# EAGLE design cryobondr-sense1-vlaqc-test2 (EAGLE 9.0.1)
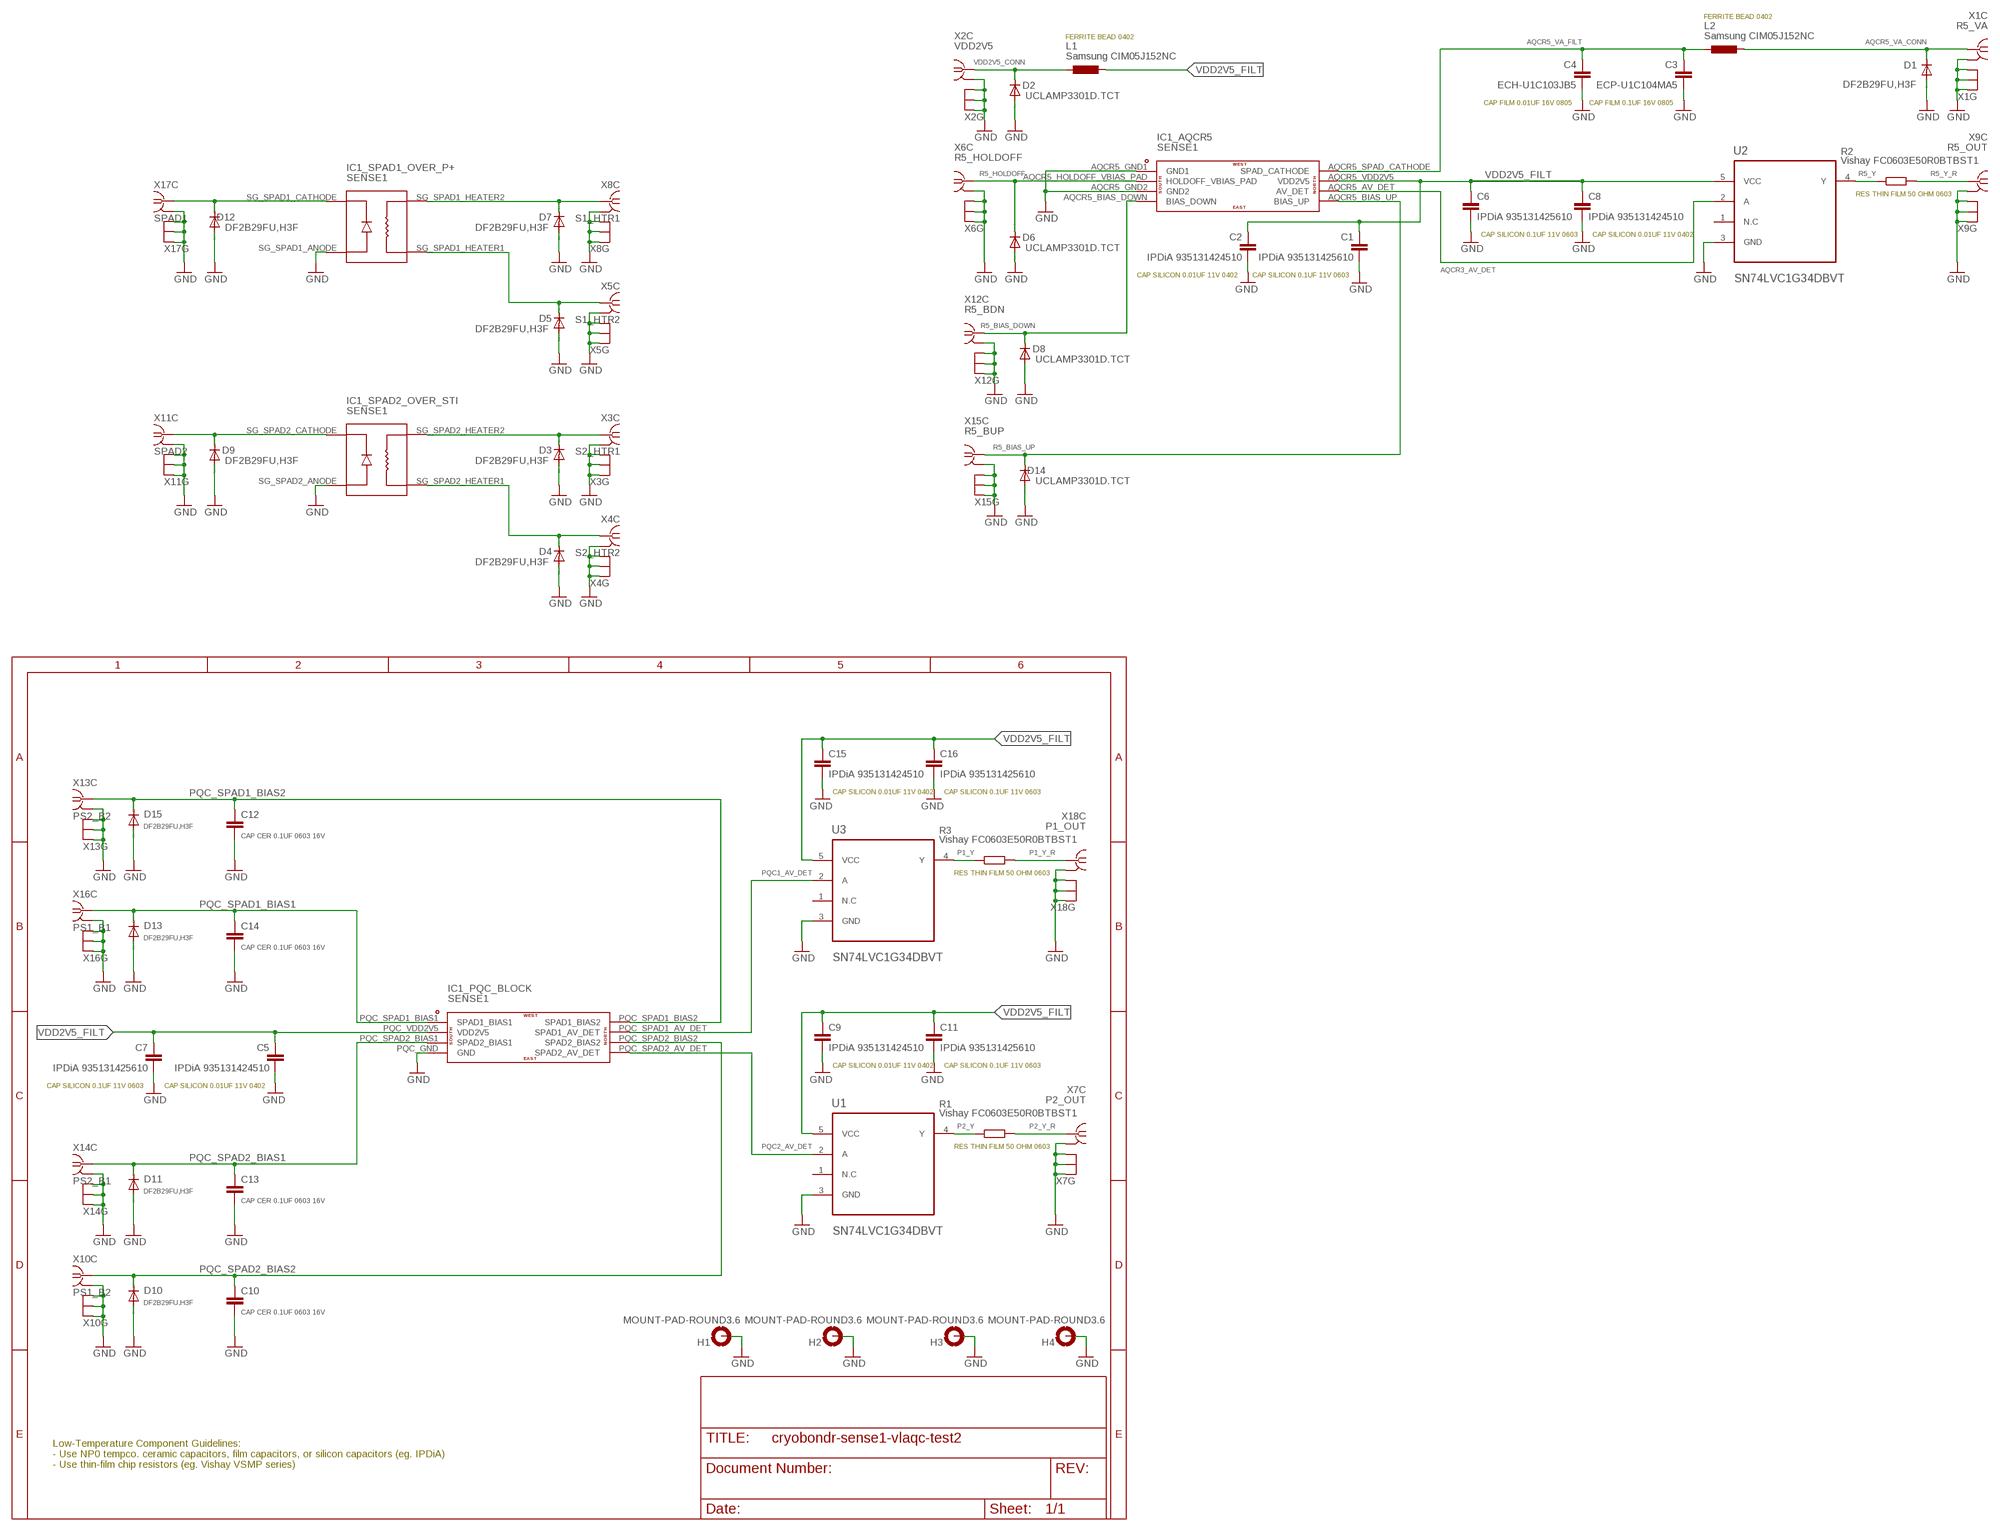
[diagram p0: schematic, sheet 1]

## Parts
C1  IPDiA 935131425610  C-EUC0603  [C0603]
C2  IPDiA 935131424510  C-EUC0402  [C0402]
C3  ECP-U1C104MA5  C-EUC0805  [C0805]
C4  ECH-U1C103JB5  C-EUC0805  [C0805]
C5  IPDiA 935131424510  C-EUC0402  [C0402]
C6  IPDiA 935131425610  C-EUC0603  [C0603]
C7  IPDiA 935131425610  C-EUC0603  [C0603]
C8  IPDiA 935131424510  C-EUC0402  [C0402]
C9  IPDiA 935131424510  C-EUC0402  [C0402]
C10  CAP CER 0.1UF 0603 16V  C-EUC0603  [C0603]
C11  IPDiA 935131425610  C-EUC0603  [C0603]
C12  CAP CER 0.1UF 0603 16V  C-EUC0603  [C0603]
C13  CAP CER 0.1UF 0603 16V  C-EUC0603  [C0603]
C14  CAP CER 0.1UF 0603 16V  C-EUC0603  [C0603]
C15  IPDiA 935131424510  C-EUC0402  [C0402]
C16  IPDiA 935131425610  C-EUC0603  [C0603]
D1  DF2B29FU,H3F  DIODE-SOD323-R  [SOD323-R]
D2  UCLAMP3301D.TCT  DIODE-SOD323-R  [SOD323-R]
D3  DF2B29FU,H3F  DIODE-SOD323-R  [SOD323-R]
D4  DF2B29FU,H3F  DIODE-SOD323-R  [SOD323-R]
D5  DF2B29FU,H3F  DIODE-SOD323-R  [SOD323-R]
D6  UCLAMP3301D.TCT  DIODE-SOD323-R  [SOD323-R]
D7  DF2B29FU,H3F  DIODE-SOD323-R  [SOD323-R]
D8  UCLAMP3301D.TCT  DIODE-SOD323-R  [SOD323-R]
D9  DF2B29FU,H3F  DIODE-SOD323-R  [SOD323-R]
D10  DF2B29FU,H3F  DIODE-SOD323-R  [SOD323-R]
D11  DF2B29FU,H3F  DIODE-SOD323-R  [SOD323-R]
D12  DF2B29FU,H3F  DIODE-SOD323-R  [SOD323-R]
D13  DF2B29FU,H3F  DIODE-SOD323-R  [SOD323-R]
D14  UCLAMP3301D.TCT  DIODE-SOD323-R  [SOD323-R]
D15  DF2B29FU,H3F  DIODE-SOD323-R  [SOD323-R]
H1  MOUNT-PAD-ROUND3.6  [3,6-PAD]
H2  MOUNT-PAD-ROUND3.6  [3,6-PAD]
H3  MOUNT-PAD-ROUND3.6  [3,6-PAD]
H4  MOUNT-PAD-ROUND3.6  [3,6-PAD]
IC1  SENSE1  SENSE1-WIREBOND-VLAQC-TEST2  [SENSE1-WIREBOND-VLAQC-TEST2]
L1  Samsung CIM05J152NC  INDUCTOR0402  [R0402]
L2  Samsung CIM05J152NC  INDUCTOR0402  [R0402]
R1  Vishay FC0603E50R0BTBST1  R-EU_R0603  [R0603]
R2  Vishay FC0603E50R0BTBST1  R-EU_R0603  [R0603]
R3  Vishay FC0603E50R0BTBST1  R-EU_R0603  [R0603]
U1  SN74LVC1G34DBVT  [SOT95P280X145-5N]
U2  SN74LVC1G34DBVT  [SOT95P280X145-5N]
U3  SN74LVC1G34DBVT  [SOT95P280X145-5N]
X1  R5_VA  MMCXBIGPAD  [MMCX-SMT-BIGPADS]
X2  VDD2V5  MMCXBIGPAD  [MMCX-SMT-BIGPADS]
X3  S2_HTR1  MMCXBIGPAD  [MMCX-SMT-BIGPADS]
X4  S2_HTR2  MMCXBIGPAD  [MMCX-SMT-BIGPADS]
X5  S1_HTR2  MMCXBIGPAD  [MMCX-SMT-BIGPADS]
X6  R5_HOLDOFF  MMCXBIGPAD  [MMCX-SMT-BIGPADS]
X7  P2_OUT  MMCXBIGPAD  [MMCX-SMT-BIGPADS]
X8  S1_HTR1  MMCXBIGPAD  [MMCX-SMT-BIGPADS]
X9  R5_OUT  MMCXBIGPAD  [MMCX-SMT-BIGPADS]
X10  PS1_B2  MMCXBIGPAD  [MMCX-SMT-BIGPADS]
X11  SPAD2  MMCXBIGPAD  [MMCX-SMT-BIGPADS]
X12  R5_BDN  MMCXBIGPAD  [MMCX-SMT-BIGPADS]
X13  PS2_B2  MMCXBIGPAD  [MMCX-SMT-BIGPADS]
X14  PS2_B1  MMCXBIGPAD  [MMCX-SMT-BIGPADS]
X15  R5_BUP  MMCXBIGPAD  [MMCX-SMT-BIGPADS]
X16  PS1_B1  MMCXBIGPAD  [MMCX-SMT-BIGPADS]
X17  SPAD1  MMCXBIGPAD  [MMCX-SMT-BIGPADS]
X18  P1_OUT  MMCXBIGPAD  [MMCX-SMT-BIGPADS]

## Nets
AQCR3_AV_DET: IC1.AQCR5_AV_DET(_AQCR5:AV_DET) U2.2(A)
AQCR5_VA_CONN: D1.C L2.2 X1.S
AQCR5_VA_FILT: C3.1 C4.1 IC1.AQCR5_SPAD_CATHODE(_AQCR5:SPAD_CATHODE) L2.1
GND: C1.2 C2.2 C3.2 C4.2 C5.2 C6.2 C7.2 C8.2 C9.2 C10.2 C11.2 C12.2 C13.2 C14.2 C15.2 C16.2 D1.A D2.A D3.A D4.A D5.A D6.A D7.A D8.A D9.A D10.A D11.A D12.A D13.A D14.A D15.A H1.B3,6(MOUNT) H2.B3,6(MOUNT) H3.B3,6(MOUNT) H4.B3,6(MOUNT) IC1.AQCR5_GND1(_AQCR5:GND1) IC1.AQCR5_GND2(_AQCR5:GND2) IC1.PQC_GND(_PQC_BLOCK:GND) IC1.SG_SPAD1_ANODE(_SPAD1_OVER_P+:SPAD_ANODE) IC1.SG_SPAD2_ANODE(_SPAD2_OVER_STI:SPAD_ANODE) U1.3(GND) U2.3(GND) U3.3(GND) X1.G1(C:GND) X1.G2(G:GND) X1.G3(G:GND) X1.G4(G:GND) X2.G1(C:GND) X2.G2(G:GND) X2.G3(G:GND) X2.G4(G:GND) X3.G1(C:GND) X3.G2(G:GND) X3.G3(G:GND) X3.G4(G:GND) X4.G1(C:GND) X4.G2(G:GND) X4.G3(G:GND) X4.G4(G:GND) X5.G1(C:GND) X5.G2(G:GND) X5.G3(G:GND) X5.G4(G:GND) X6.G1(C:GND) X6.G2(G:GND) X6.G3(G:GND) X6.G4(G:GND) X7.G1(C:GND) X7.G2(G:GND) X7.G3(G:GND) X7.G4(G:GND) X8.G1(C:GND) X8.G2(G:GND) X8.G3(G:GND) X8.G4(G:GND) X9.G1(C:GND) X9.G2(G:GND) X9.G3(G:GND) X9.G4(G:GND) X10.G1(C:GND) X10.G2(G:GND) X10.G3(G:GND) X10.G4(G:GND) X11.G1(C:GND) X11.G2(G:GND) X11.G3(G:GND) X11.G4(G:GND) X12.G1(C:GND) X12.G2(G:GND) X12.G3(G:GND) X12.G4(G:GND) X13.G1(C:GND) X13.G2(G:GND) X13.G3(G:GND) X13.G4(G:GND) X14.G1(C:GND) X14.G2(G:GND) X14.G3(G:GND) X14.G4(G:GND) X15.G1(C:GND) X15.G2(G:GND) X15.G3(G:GND) X15.G4(G:GND) X16.G1(C:GND) X16.G2(G:GND) X16.G3(G:GND) X16.G4(G:GND) X17.G1(C:GND) X17.G2(G:GND) X17.G3(G:GND) X17.G4(G:GND) X18.G1(C:GND) X18.G2(G:GND) X18.G3(G:GND) X18.G4(G:GND)
P1_Y: R3.1 U3.4(Y)
P1_Y_R: R3.2 X18.S
P2_Y: R1.1 U1.4(Y)
P2_Y_R: R1.2 X7.S
PQC1_AV_DET: IC1.PQC_SPAD1_AV_DET(_PQC_BLOCK:SPAD1_AV_DET) U3.2(A)
PQC2_AV_DET: IC1.PQC_SPAD2_AV_DET(_PQC_BLOCK:SPAD2_AV_DET) U1.2(A)
PQC_SPAD1_BIAS1: C14.1 D13.C IC1.PQC_SPAD1_BIAS1(_PQC_BLOCK:SPAD1_BIAS1) X16.S
PQC_SPAD1_BIAS2: C12.1 D15.C IC1.PQC_SPAD1_BIAS2(_PQC_BLOCK:SPAD1_BIAS2) X13.S
PQC_SPAD2_BIAS1: C13.1 D11.C IC1.PQC_SPAD2_BIAS1(_PQC_BLOCK:SPAD2_BIAS1) X14.S
PQC_SPAD2_BIAS2: C10.1 D10.C IC1.PQC_SPAD2_BIAS2(_PQC_BLOCK:SPAD2_BIAS2) X10.S
R5_BIAS_DOWN: D8.C IC1.AQCR5_BIAS_DOWN(_AQCR5:BIAS_DOWN) X12.S
R5_BIAS_UP: D14.C IC1.AQCR5_BIAS_UP(_AQCR5:BIAS_UP) X15.S
R5_HOLDOFF: D6.C IC1.AQCR5_HOLDOFF_VBIAS_PAD(_AQCR5:HOLDOFF_VBIAS_PAD) X6.S
R5_Y: R2.1 U2.4(Y)
R5_Y_R: R2.2 X9.S
SPAD1_CATH: D12.C IC1.SG_SPAD1_CATHODE(_SPAD1_OVER_P+:SPAD_CATHODE) X17.S
SPAD1_HTR: D7.C IC1.SG_SPAD1_HEATER2(_SPAD1_OVER_P+:SPAD_HEATER2) X8.S
SPAD1_HTR1: D3.C IC1.SG_SPAD2_HEATER2(_SPAD2_OVER_STI:SPAD_HEATER2) X3.S
SPAD2_CATH: D9.C IC1.SG_SPAD2_CATHODE(_SPAD2_OVER_STI:SPAD_CATHODE) X11.S
SPAD2_HTR: D5.C IC1.SG_SPAD1_HEATER1(_SPAD1_OVER_P+:SPAD_HEATER1) X5.S
SPAD2_HTR1: D4.C IC1.SG_SPAD2_HEATER1(_SPAD2_OVER_STI:SPAD_HEATER1) X4.S
VDD2V5_CONN: D2.C L1.1 X2.S
VDD2V5_FILT: C1.1 C2.1 C5.1 C6.1 C7.1 C8.1 C9.1 C11.1 C15.1 C16.1 IC1.AQCR5_VDD2V5(_AQCR5:VDD2V5) IC1.PQC_VDD2V5(_PQC_BLOCK:VDD2V5) L1.2 U1.5(VCC) U2.5(VCC) U3.5(VCC)
Unconnected: U1.1(N.C) U2.1(N.C) U3.1(N.C)

## Notes on the sheet
- FERRITE BEAD 0402
- FERRITE BEAD 0402
- CAP FILM 0.01UF 16V 0805 | CAP FILM 0.1UF 16V 0805
- RES THIN FILM 50 OHM 0603
- CAP SILICON 0.1UF 11V 0603 | CAP SILICON 0.01UF 11V 0402
- CAP SILICON 0.01UF 11V 0402 | CAP SILICON 0.1UF 11V 0603
- CAP SILICON 0.01UF 11V 0402 | CAP SILICON 0.1UF 11V 0603
- RES THIN FILM 50 OHM 0603
- CAP SILICON 0.01UF 11V 0402 | CAP SILICON 0.1UF 11V 0603
- CAP SILICON 0.1UF 11V 0603 | CAP SILICON 0.01UF 11V 0402
- RES THIN FILM 50 OHM 0603
- Low-Temperature Component Guidelines:
  - Use NP0 tempco. ceramic capacitors, film capacitors, or silicon capacitors (eg. IPDiA)
  - Use thin-film chip resistors (eg. Vishay VSMP series)

## Library data of the parts
C1-C16 = rcl-modified-footprints:C-EU: CAPACITOR, European symbol
D1-D15 = diode:DIODE-: DIODE
H1-H4 = holes:MOUNT-PAD-ROUND: MOUNTING PAD, round
IC1 = meng:SENSE1-WIREBOND-VLAQC-TEST2
L1 L2 = meng:INDUCTOR
R1-R3 = rcl-modified-footprints:R-EU_: RESISTOR, European symbol
U1-U3 = Texas Instruments_By_element14_Batch_1:SN74LVC1G34DBVT: SINGLE BUFFER GATE; MPN: SN74LVC1G34DBVT; OC_FARNELL: 1494933; OC_NEWARK: 01J0788; PACKAGE: SOT-5; SPICEPREFIX: X; SUPPLIER: TEXAS INSTRUMENTS
X1-X18 = meng:MMCX

## Net classes
0 default: width 0.152 mm, drill 0.2 mm, clearance 0.152 mm

## Board
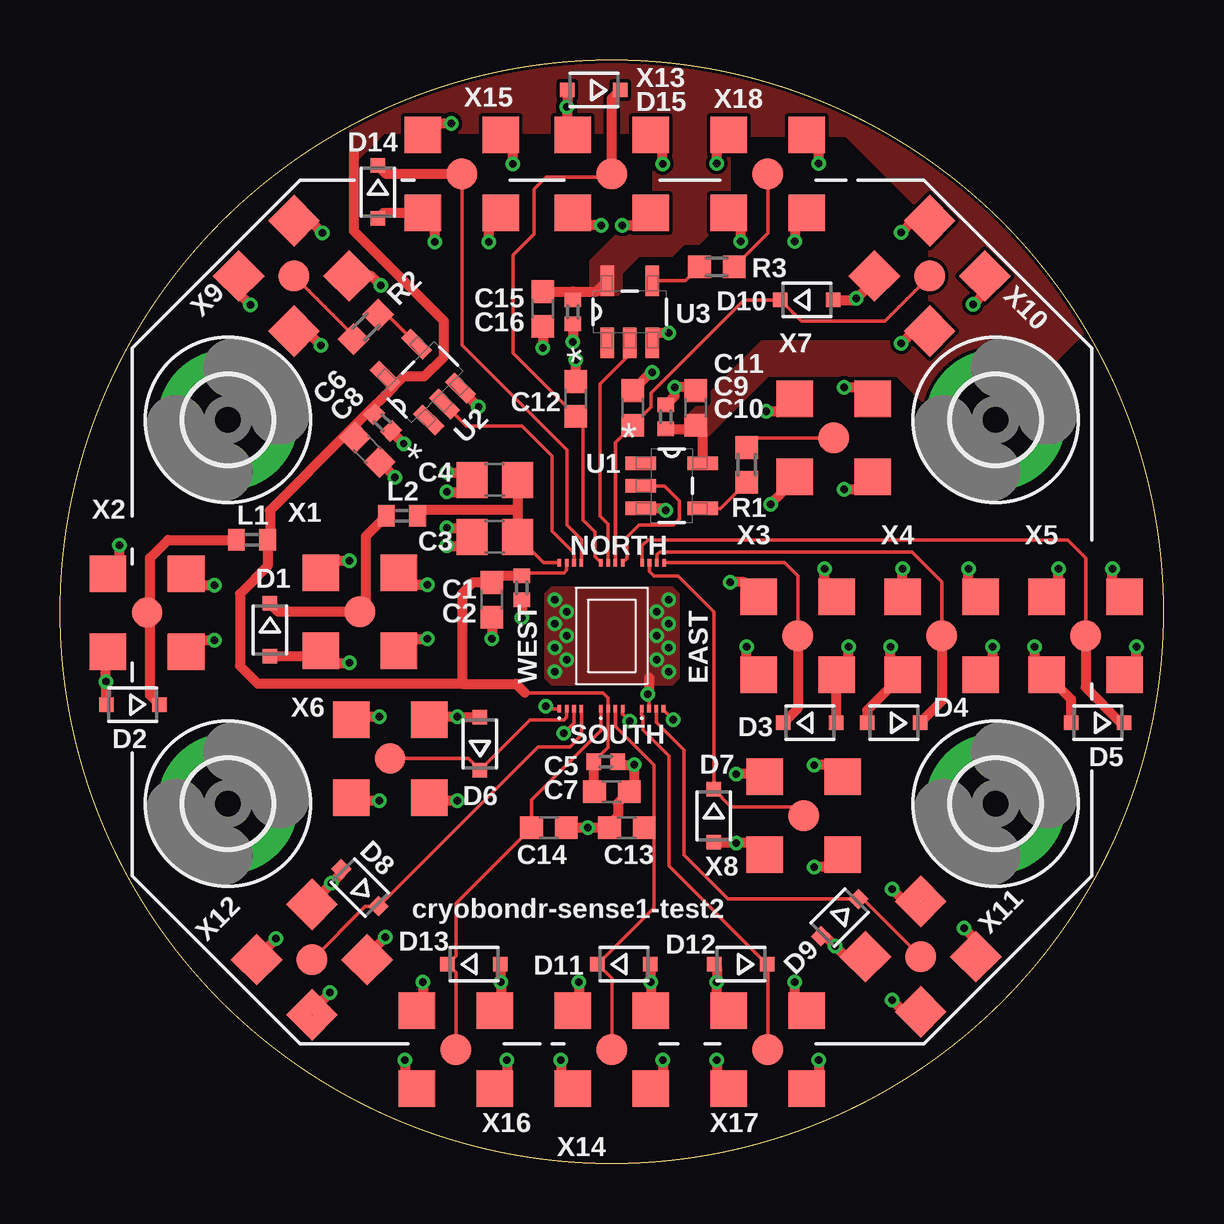
[diagram p1: board, top side]
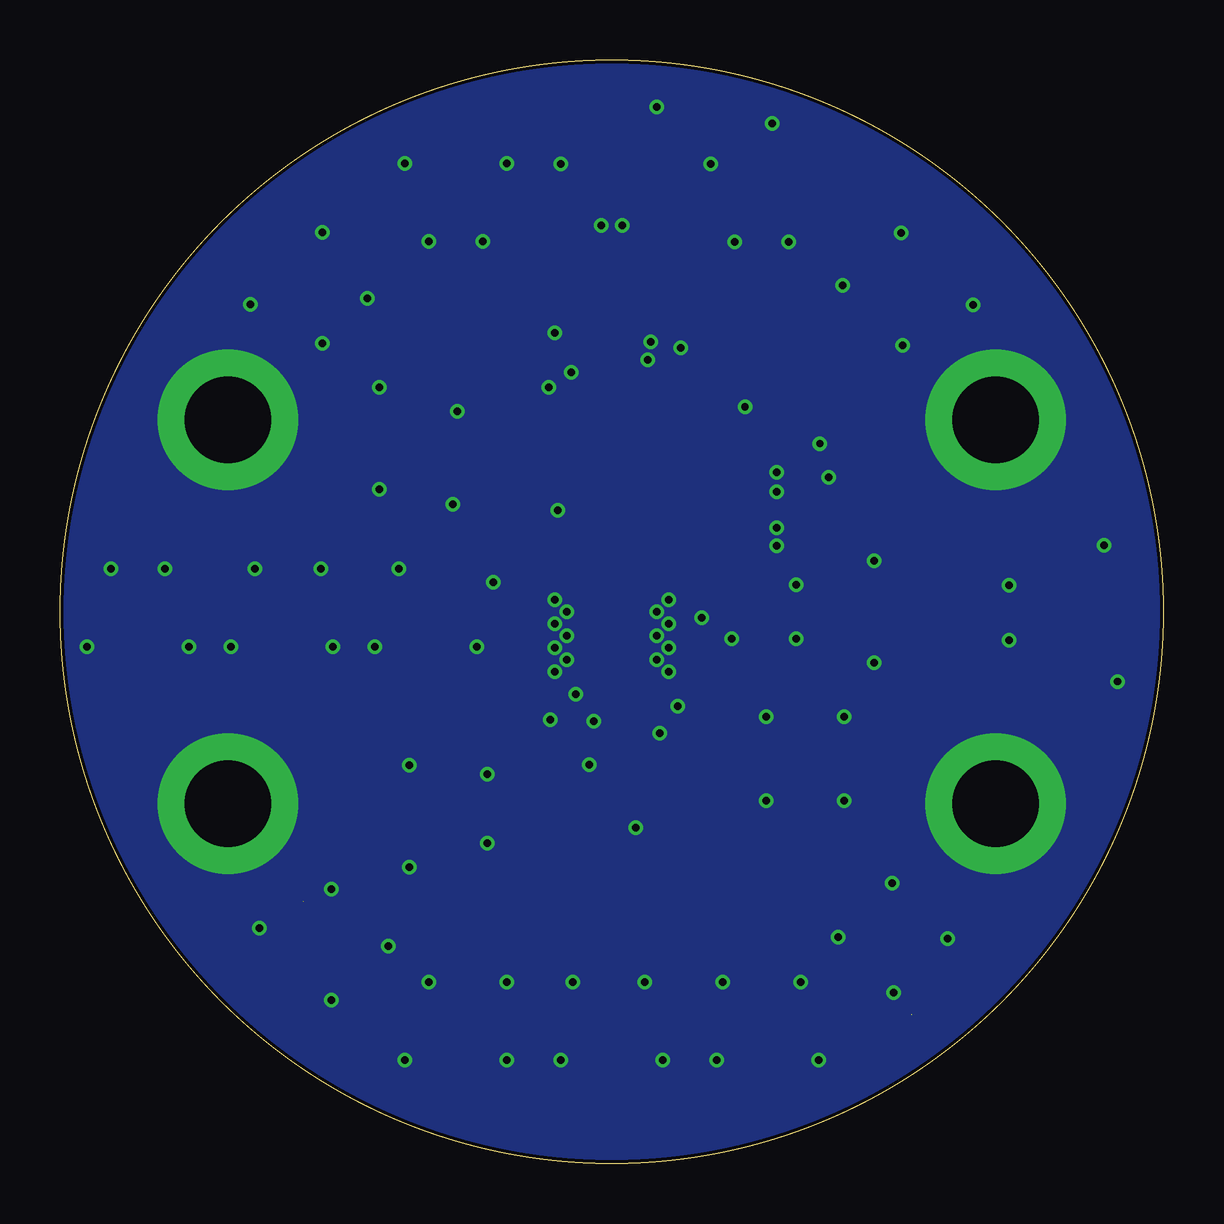
[diagram p2: board, bottom side, seen from below]

Size 46 x 46 mm. Coordinates in mm from the lower left corner, seen from the top.
Outline: circle at 23,23 radius 23
Copper layers (1*16): Top 0.035mm / dielectric 1.5mm / Bottom 0.035mm
Design rules "default *": minimum track width 6mil, minimum drill 0.2mm, track to track 6mil, track to pad 6mil, pad to pad 6mil, via to via 6mil, smd to smd 0mil, copper to edge 6mil, drill to drill 6mil, minimum pad ring 6mil, minimum via ring 6mil, stop-mask expansion 2mil, vias tented up to drill 1mm, thermal gap 6mil

### Footprints (pad centres in the part's own frame; a part is rotated, then mirrored left to right if it is on the bottom)
C0603 = smd 0.95 x 0.95: 1 -0.725,0; 2 0.725,0
C0402 = smd 0.6 x 0.7: 1 -0.5,0; 2 0.5,0
C0805 = smd 1.3 x 1.5: 1 -0.95,0; 2 0.95,0
SOD323-R = smd 0.6 x 0.6: A 1.1,0; C -1.1,0
3,6-PAD = drill 3.6 pad 5.842: B3,6 0,0
SENSE1-WIREBOND-VLAQC-TEST2 = smd 0.152 x 0.305: AQCR5_AV_DET -1.575,3.048; AQCR5_BIAS_DOWN -1.27,-3.048; AQCR5_BIAS_UP -1.27,3.048; AQCR5_GND1 -1.575,-3.048; AQCR5_GND2 -2.184,-3.048; AQCR5_HOLDOFF_VBIAS_PAD -1.88,-3.048; AQCR5_SPAD_CATHODE -2.184,3.048; AQCR5_VDD2V5 -1.88,3.048; PQC_GND 0.457,-3.048; PQC_SPAD1_AV_DET -0.152,3.048; PQC_SPAD1_BIAS1 -0.457,-3.048; PQC_SPAD1_BIAS2 -0.457,3.048; PQC_SPAD2_AV_DET 0.457,3.048; PQC_SPAD2_BIAS1 0.152,-3.048; PQC_SPAD2_BIAS2 0.152,3.048; PQC_VDD2V5 -0.152,-3.048; SG_SPAD1_ANODE 1.549,-3.048; SG_SPAD1_CATHODE 1.245,-3.048; SG_SPAD1_HEATER1 1.27,3.048; SG_SPAD1_HEATER2 1.575,3.048; SG_SPAD2_ANODE 2.159,-3.048; SG_SPAD2_CATHODE 1.854,-3.048; SG_SPAD2_HEATER1 1.88,3.048; SG_SPAD2_HEATER2 2.184,3.048
R0402 = smd 0.7 x 0.9: 1 -0.65,0; 2 0.65,0
R0603 = smd 0.95 x 0.95: 1 -0.725,0; 2 0.725,0
SOT95P280X145-5N = smd 1.27 x 0.559: 1 -1.295,0.94; 2 -1.295,0; 3 -1.295,-0.94; 4 1.295,-0.94; 5 1.295,0.94
MMCX-SMT-BIGPADS = smd 1.524 x 1.524: G1 -1.626,1.626; G2 1.626,1.626; G3 1.626,-1.626; G4 -1.626,-1.626 | smd 1.27 x 1.27: S 0,0

### Placement (x,y rotation side)
C1  18,23.5 270 top
C2  19.25,24 270 top
C3  18.12,26.12 180 top
C4  18.12,28.5 180 top
C5  22.75,16.75 0 top
C6  12.81,29.76 315 top
C7  23,15.5 0 top
C8  13.44,30.89 315 top
C9  25.25,31.12 90 top
C10  23.88,31.5 90 top
C11  26.5,31.5 90 top
C12  21.5,31.88 90 top
C13  23.62,14 180 top
C14  20.38,14 0 top
C15  21.38,35.5 270 top
C16  20.12,35.62 270 top
D1  8.75,22.25 270 top
D2  3.04,19.13 180 top
D3  31.25,18.38 0 top
D4  34.75,18.38 180 top
D5  43.25,18.38 180 top
D6  17.5,17.5 90 top
D7  27.25,14.5 270 top
D8  12.5,11.5 135 top
D9  32.5,10.25 225 top
D10  31.12,36 0 top
D11  23.5,8.31 0 top
D12  28.38,8.31 180 top
D13  17.25,8.31 0 top
D14  13.25,40.5 270 top
D15  22.25,44.75 180 top
H1  39,15 0 top
H2  7,15 0 top
H3  39,31 0 top
H4  7,31 0 top
IC1  23,22 0 top
L1  8,26 0 top
L2  14.25,27 180 top
R1  28.62,29.12 90 top
R2  12.75,34.88 225 top
R3  27.38,37.38 0 top
U1  25.5,28.25 0 top
U2  15.12,32.57 135 top
U3  23.75,35.5 90 top
X1  12.5,23 0 top
X2  3.63,22.96 90 top
X3  30.75,22 0 top
X4  36.75,22 0 top
X5  42.75,22 0 top
X6  13.76,16.88 0 top
X7  32.25,30.25 0 top
X8  31,14.5 0 top
X9  9.75,37 45 top
X10  36.25,37 45 top
X11  35.88,8.62 45 top
X12  10.5,8.5 45 top
X13  23,41.25 0 top
X14  23,4.75 0 top
X15  16.75,41.25 0 top
X16  16.5,4.75 0 top
X17  29.5,4.75 0 top
X18  29.5,41.25 0 top

### Tracks (layer width: path | path; a pad name or v marks a point on that pad's centre or on a via)
AQCR3_AV_DET
  Top 0.152: 16.27,31.42 U2.2 16.95,30.75 19.25,30.75 20.5,29.5 20.5,26.38 21.43,25.45 IC1.AQCR5_AV_DET
AQCR5_VA_CONN
  Top 0.406: D1.C 9.1,23 X1.S 12.5,23.25 12.75,23.5 12.75,26.15 L2.2
AQCR5_VA_FILT
  Top 0.152: IC1.AQCR5_SPAD_CATHODE 20.15,25.05 C3.1
  Top 0.406: C4.1 19.07,27.25 | 19.07,27.25 C3.1 | 19.07,27.25 15.15,27.25 L2.1
GND  (via drill 0.3)  (2 unrouted)
  Top 0.152: IC1.AQCR5_GND2 20.36,18.95 v20.25,19.06 | IC1.AQCR5_GND1 21.43,18.36 v21,17.94 | IC1.PQC_GND 23.46,18.73 v23.75,18.44 | IC1.SG_SPAD2_ANODE 25.16,18.9 v25.56,18.5 | v24.5,19.56 24.55,19.51 IC1.SG_SPAD1_ANODE
  Top 0.406: C2.2 v19.25,22.75 | C1.2 v18,21.88 | X18.G3 30.62,39.12 v30.62,38.44 | v28.38,38.44 28.38,39.12 X18.G4 | v27.38,41.69 27.38,42.38 X18.G1 | v31.62,41.69 31.62,42.38 X18.G2 | C15.2 v21.38,34.25 | C16.2 v20.12,34 | C8.2 v14.33,30.01 | C6.2 v13.96,28.61 | v12.06,20.88 11.37,20.88 X1.G4 10.65,21.15 D1.A | v12.06,25.12 11.37,25.12 X1.G1 | v15.31,24.12 14.63,24.12 X1.G2 | v15.31,21.88 14.63,21.88 X1.G3 | v6.44,24.11 5.74,24.11 X2.G3 | v6.44,21.81 5.74,21.81 X2.G4 | v16.12,26.5 16.8,26.5 C3.2 16.8,25.75 v16.12,25.75 | X11.G2 35.2,10.92 v34.69,11.44 | v37.69,9.81 38.17,9.33 X11.G3 | v34.69,6.81 35.17,6.33 X11.G4 | v25.38,34.62 24.69,34.62 U3.3 | 23.88,15.65 C7.2 | v27.38,4.31 27.38,3.62 X17.G4 | v31.62,4.31 31.62,3.62 X17.G3 | 28.38,6.88 X17.G1 27.38,6.88 v27.38,7.56 27.38,8.21 D12.A | 1.94,21.27 X2.G1 1.92,21.24 v1.92,20.09 1.92,19.15 D2.A | v13.31,15.12 12.27,15.12 X6.G4 | v16.56,15.12 15.52,15.12 X6.G3 | X6.G2 15.51,18.62 v16.56,18.62 16.59,18.6 D6.A | v13.31,18.62 12.26,18.62 X6.G1 | v9,9.38 8.2,8.58 X12.G1 | X12.G2 10.5,10.88 v11.31,11.69 11.72,12.1 D8.A | v13.56,9.44 12.8,8.67 X12.G3 | v11.25,7.12 10.5,6.38 X12.G4 | v21.62,7.56 21.62,6.63 X14.G1 | X16.G2 18.38,6.62 v18.38,7.56 18.38,8.29 D13.A | v15.12,7.56 15.12,6.63 X16.G1 | v14.38,4.31 14.38,3.62 X16.G4 | v18.62,4.31 18.62,3.62 X16.G3 | v20.88,4.31 20.88,3.62 X14.G4 | v25.12,4.31 25.12,3.62 X14.G3 | X14.G2 v24.62,7.56 24.62,8.29 D11.A | 31.38,6.62 X17.G2 30.62,6.88 v30.62,7.56 | D14.A 13.47,39.62 X15.G4 15.62,39.12 v15.62,38.42 | X9.G2 10.43,39.3 v10.94,38.8 | v7.94,35.8 7.45,36.28 X9.G1 | v10.87,34.11 10.28,34.7 X9.G4 | v13.37,36.61 12.98,37 X9.G3 | X15.G3 17.87,39.12 v17.87,38.42
  Top 0.406: X15.G2 18.87,42.38 v18.87,41.67 | X15.G1 15.61,43.36 v16.31,43.36 | 20.87,42.38 X13.G1 21.15,43.1 21.15,44.07 | v25.12,41.67 25.12,42.38 X13.G2 | v23.44,39.11 24.11,39.11 X13.G3 | v22.56,39.11 21.89,39.11 X13.G4 | X10.G1 33.95,36.83 v33.19,36.06 33.12,36 D10.A | X10.G4 35.58,34.7 v35.06,34.19 | v38.06,35.81 38.55,36.3 X10.G3 | v35.06,38.81 35.55,39.3 X10.G2 | X3.G4 28.62,20.88 v28.62,21.55 | X3.G1 28.52,24.23 v27.94,24.23 | X3.G2 31.87,24.13 v31.87,24.8 | v32.87,21.55 32.87,20.87 X3.G3 32.35,20.35 D3.A | v34.62,21.55 34.62,20.88 X4.G4 33.65,18.9 D4.A | X4.G1 | X4.G1 v35.12,24.8 | X4.G2 37.87,24.13 v37.87,24.8 | v38.87,21.55 38.87,20.87 X4.G3 | v40.62,21.55 40.62,20.88 X5.G4 42.15,19.35 D5.A | X5.G1 41.62,24.12 v41.62,24.8 | X5.G2 43.87,24.13 v43.87,24.8 | X5.G3 44.87,20.87 v44.87,21.55 | 28.87,13.38 X8.G4 28.89,13.36 v28.19,13.36 27.29,13.36 D7.A | v32.69,32.36 33.39,32.36 X7.G2 | v32.69,28.11 33.36,28.11 X7.G3 | U2.3 16.66,32.32 v17.45,31.54 | C11.2 26.37,32.36 v25.62,32.36 25.62,32 C9.2 | v25.25,27.23 25.17,27.31 U1.3 | X8.G1 29.27,16.23 v28.19,16.23 | X8.G2 32.14,16.61 v31.44,16.61 | X8.G3 32.11,12.36 v31.44,12.36 | v29.44,31.36 30.11,31.36 X7.G1 | v29.62,27.48 30.62,28.48 X7.G4 | X11.G1 32.75,8.62 v32.31,9.06 31.9,9.47 D9.A | C4.2 17.15,28.48 | 17.15,28.48 17.15,28.27 | C14.2 v22,14 C13.2 22.9,14.15 23.25,14.5 23.25,15.03 C7.2 | C12.2 v21.5,33.5 | C10.2 24.63,32.98 v24.69,32.98 | v24.5,19.56 24.56,19.62 24.56,20.25 | 23.31,16.69 C5.2 23.38,16.62 v23.94,16.62 23.94,15.71 C7.2 | v16.12,28.81 16.81,28.81 17.15,28.48 | v16.12,28 16.68,28 17.15,28.48 | v2.48,25.77 2.48,25.05 X2.G2 | D15.A 21.15,44.07 | 21.15,44.07 v21.12,44.05
  other vias: 20.62,23.5 20.62,22.5 20.62,21.5 20.62,20.5 25.38,22.5 25.38,21.5 25.38,20.5 25.38,23.5 21.12,23 21.12,22 21.12,21 24.88,21 24.88,22 24.88,23
  pour Bottom (no thermals): 0,0 46,0 46.25,46 0.25,46
  pour Top: 20.25,20.25 20.5,20 25.5,20 25.75,20.25 25.75,23.75 25.5,24 20.5,24 20.25,23.75
P1_Y
  Top 0.152: R3.1 26.07,36.8 U3.4
P1_Y_R
  Top 0.152: X18.S 29.5,38.77 R3.2
P2_Y
  Top 0.152: U1.4 27.54,27.31 R1.1
P2_Y_R
  Top 0.152: X7.S 29.02,30.25 R1.2
PQC1_AV_DET
  Top 0.152: U3.2 23.75,33.75 22.5,32.5 22.5,27 22.85,26.65 IC1.PQC_SPAD1_AV_DET
PQC2_AV_DET
  Top 0.152: IC1.PQC_SPAD2_AV_DET 23.62,25.22 23.62,26.12 24.12,26.62 25.56,26.62 25.81,26.88 25.81,27.62 25.19,28.25 U1.2
PQC_SPAD1_BIAS1
  Top 0.152: X16.S 16.5,7.96 D13.C 16.5,8.66 16.5,10.85 C14.1 19.65,15.15 22.54,18.04 IC1.PQC_SPAD1_BIAS1
PQC_SPAD1_BIAS2
  Top 0.152: IC1.PQC_SPAD1_BIAS2 22.29,25.3 22.29,26.33 21.79,26.83 21.79,30.86 C12.1 18.88,33.77 18.88,37.88 19.75,38.75 19.75,40.62 20.25,41.12 22.88,41.12 X13.S
  Top 0.406: X13.S 23,44.4 D15.C
PQC_SPAD2_BIAS1
  Top 0.152: X14.S 23,7.71 D11.C 24.75,10.66 24.75,14 | IC1.PQC_SPAD2_BIAS1 23.15,18.22 24.75,16.62 24.75,14 | C13.1 24.75,14
PQC_SPAD2_BIAS2
  Top 0.152: X10.S 34.38,35.12 30.9,35.12 D10.C 28.5,36 24.62,32.12 24.62,31.52 C10.1 23.15,30.05 IC1.PQC_SPAD2_BIAS2
R5_BIAS_DOWN
  Top 0.152: IC1.AQCR5_BIAS_DOWN 21.73,17.86 21.25,17.38 19.93,17.38 D8.C 12.72,10.72 X12.S
R5_BIAS_UP
  Top 0.152: IC1.AQCR5_BIAS_UP 21.73,26.02 21.12,26.62 21.12,29.75 16.75,34.12 X15.S
  Top 0.406: X15.S 13.6,41.25 D14.C
R5_HOLDOFF
  Top 0.152: IC1.AQCR5_HOLDOFF_VBIAS_PAD 21.12,18.62 21,18.5 19.6,18.5 D6.C 17.02,16.88 X6.S
R5_Y
  Top 0.152: U2.4 13.64,35.39 R2.1
R5_Y_R
  Top 0.152: X9.S 12.24,34.51 R2.2
SPAD1_CATH
  Top 0.152: X17.S 29.5,8.29 D12.C 25.38,12.41 25.38,17 24.31,18.07 24.31,18.63 24.25,18.69 IC1.SG_SPAD1_CATHODE
SPAD1_HTR
  Top 0.152: IC1.SG_SPAD1_HEATER2 24.57,24.68 24.75,24.5 25.75,24.5 27.25,23 D7.C 27.98,14.88 30.62,14.88 X8.S
SPAD1_HTR1
  Top 0.152: IC1.SG_SPAD2_HEATER2 30.2,25.05 30.75,24.5 X3.S
  Top 0.406: X3.S 30.75,18.98 D3.C
SPAD2_CATH
  Top 0.152: X11.S 33.47,11.03 D9.C 27.85,11.03 26,12.88 26,17.25 24.85,18.4 IC1.SG_SPAD2_CATHODE
SPAD2_HTR
  Top 0.152: IC1.SG_SPAD1_HEATER1 24.27,25.77 24.5,26 42,26 42.75,25.25 X5.S
  Top 0.406: X5.S 42.75,19.85 44.23,18.38 D5.C
SPAD2_HTR1
  Top 0.152: IC1.SG_SPAD2_HEATER1 24.88,25.38 25,25.5 35.5,25.5 36.75,24.25 X4.S
  Top 0.406: X4.S 36.75,19.27 D4.C
VDD2V5_CONN
  Top 0.406: D2.C 3.75,19.52 3.75,22.84 X2.S 3.75,23.07 3.75,25.25 4.5,26 L1.1
VDD2V5_FILT
  Top 0.152: 13.56,32.02 13.54,32.02 | C2.1 19.38,24.62 21,24.62 21.12,24.75 IC1.AQCR5_VDD2V5 | 19.38,19.62 22.62,19.62 22.85,19.4 IC1.PQC_VDD2V5 22.85,17.35 C5.1
  Top 0.406: C2.1 18.27,24.5 C1.1 17.23,24.23 16.75,23.75 16.75,20 | C7.1 22.25,15.53 C5.1 | 16.75,20 8.25,20 7.5,20.75 7.5,23.75 8.65,24.9 L1.2 8.75,26.1 8.75,27.22 12.01,30.49 | 16.75,20 19,20 19.38,19.62 | C16.1 21.38,36.35 | 21.38,36.35 22.36,36.35 U3.5 | C15.1 21.38,36.35 | 12.25,42.12 12.25,38.88 16,35.12 16,33.62 15.2,32.82 14.35,32.82 13.89,32.36 | 13.89,32.36 13.54,32.02 12.95,31.42 | U2.5 13.89,32.48 13.89,32.36 | U1.5 26.8,30.48 C11.1 26.35,30.62 C9.1 | 12.95,31.42 12.01,30.49 | C6.1 12.08,30.49 12.01,30.49 | C8.1 12.95,31.38 12.95,31.42
  pour Top (no thermals): 12.12,38.88 12.12,44 13.12,45 15.12,47 29.25,47 35.75,47 44.75,38 44.75,36.75 39,31 36.75,31 34.88,32.88 29.5,32.88 27,30.38 26.12,30.38 26.12,31.12 29.25,34.25 35.12,34.25 36.25,35.38 36.25,39.38 32.75,42.88 31.25,42.88 27.88,42.88 27.88,39.25 27.5,39.25 26.62,38.38 26,38.38 25.5,37.88 24.12,37.88 23.38,37.12 23.38,36.38 23.25,36.25 22.12,36.25 22.12,37.62 24.75,40.25 24.75,43 13.5,43 12.38,41.88 12.38,38.88

### Text on the board
tPlace: NORTH | WEST | EAST | SOUTH | cryobondr-sense1-test2